# EAGLE design Gyro Board (EAGLE 6.5.0)
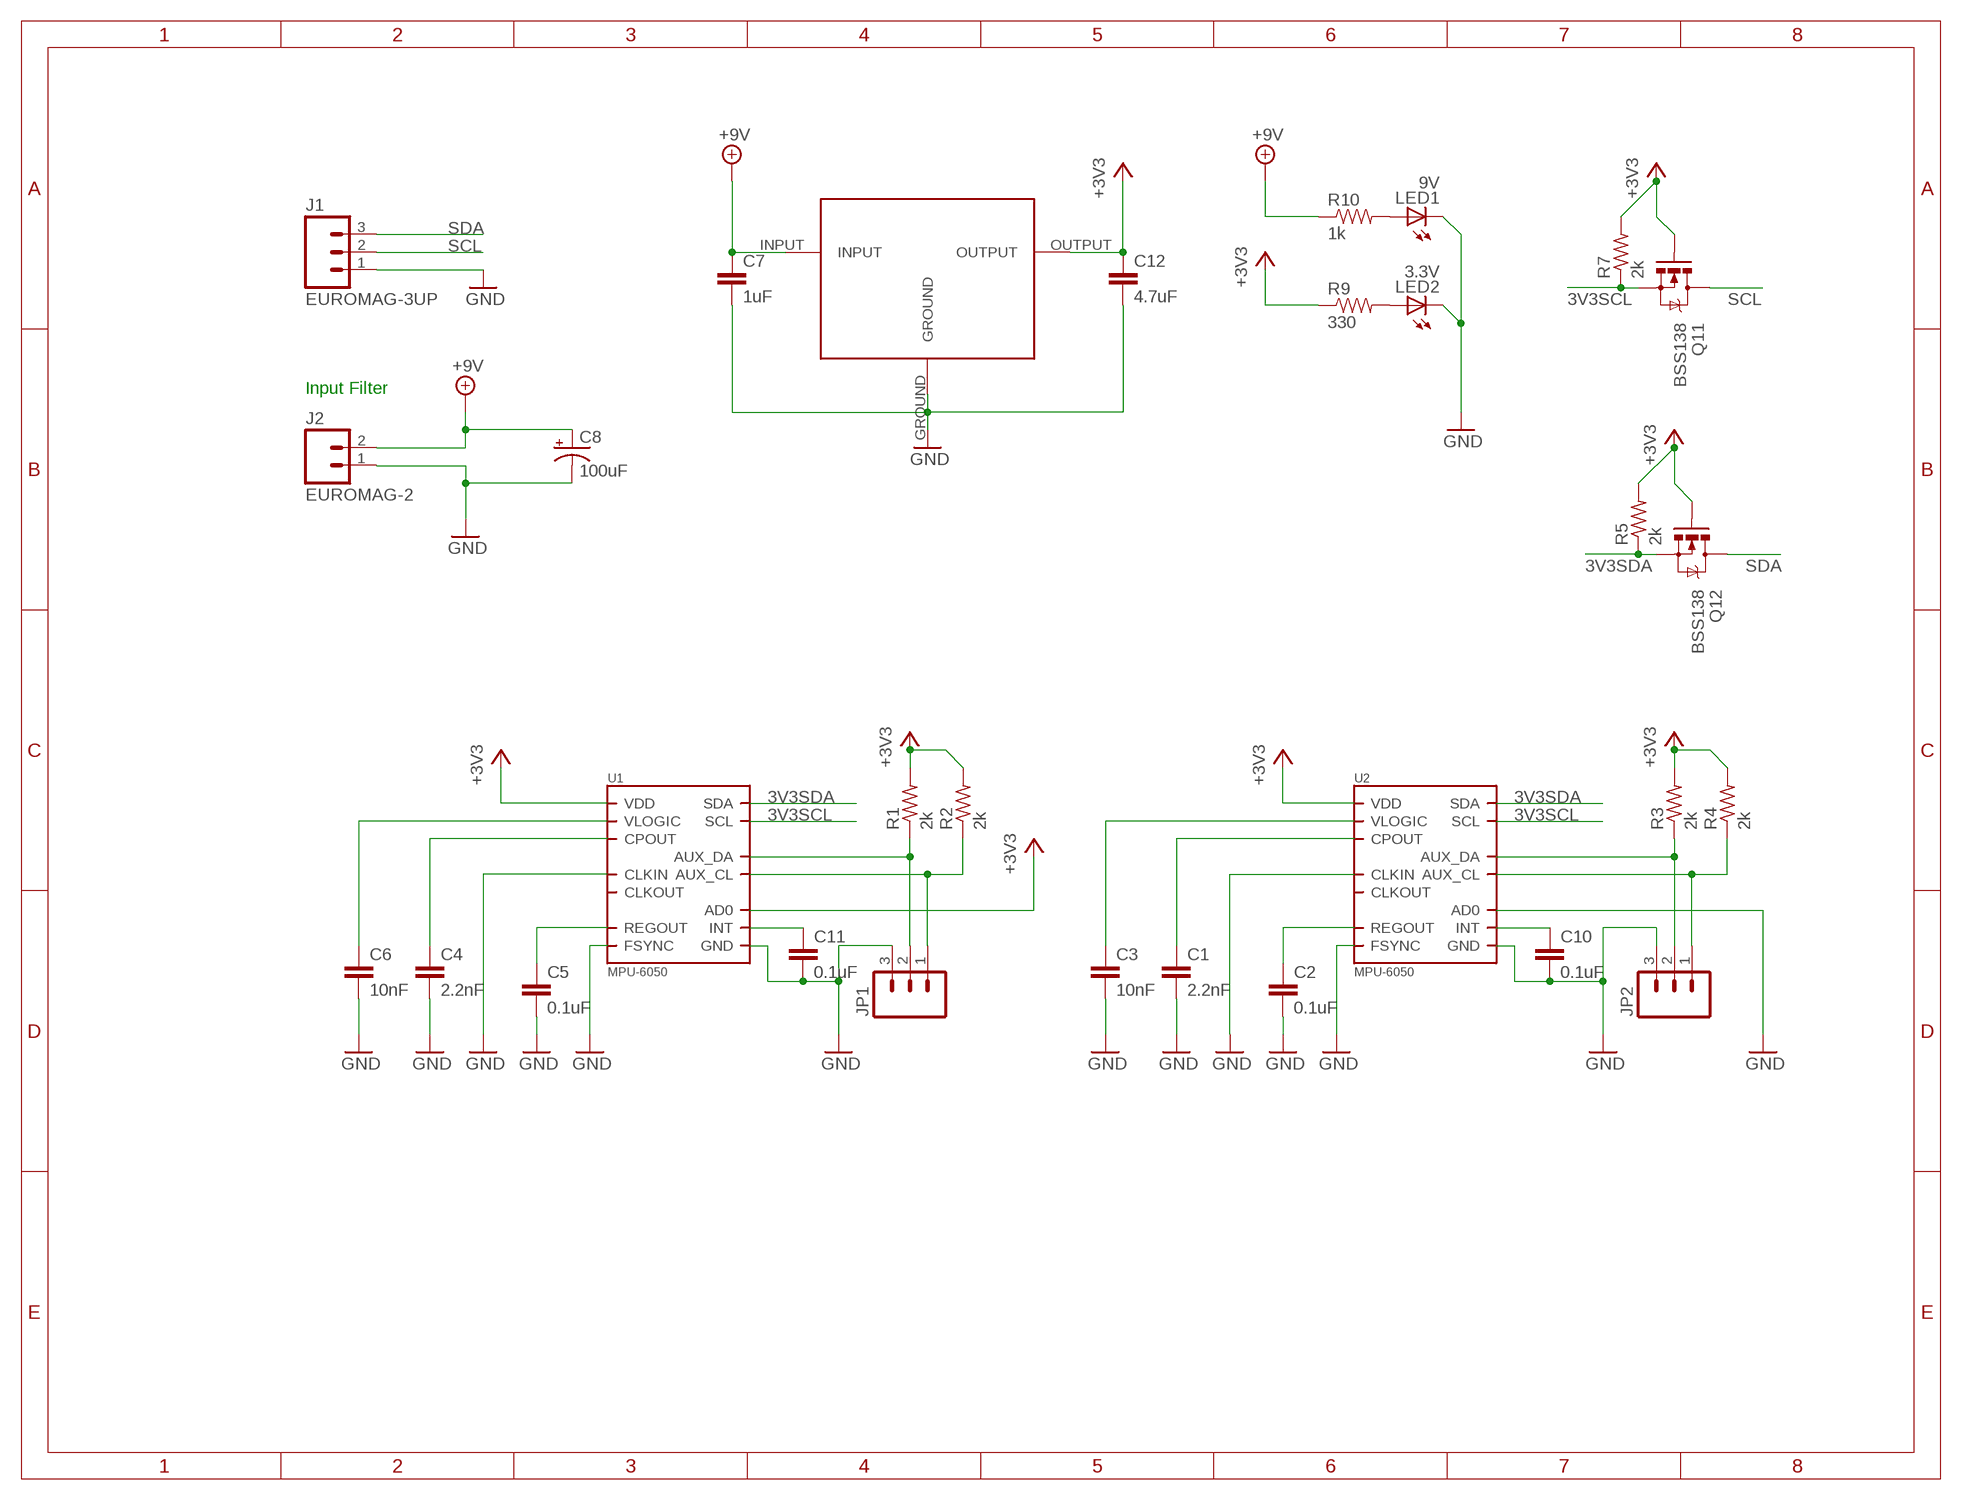
[diagram p0: schematic, sheet 1]

## Parts
3.3V  LP2950  [TO-252]
C1  2.2nF  CAP0805  [0805]
C2  0.1uF  CAP0805  [0805]
C3  10nF  CAP0805  [0805]
C4  2.2nF  CAP0805  [0805]
C5  0.1uF  CAP0805  [0805]
C6  10nF  CAP0805  [0805]
C7  1uF  CAP0805  [0805]
C8  100uF  CPOL-US153CLV-0605  [153CLV-0605]
C10  0.1uF  CAP0805  [0805]
C11  0.1uF  CAP0805  [0805]
C12  4.7uF  CAP0805  [0805]
J1  EUROMAG-3UP  [M3-UP]
J2  EUROMAG-2  [M2-UP]
JP1  M03LOCK  [1X03_LOCK]
JP2  M03LOCK  [1X03_LOCK]
LED1  9V  LEDCHIP-LED0805  [CHIP-LED0805]
LED2  3.3V  LEDCHIP-LED0805  [CHIP-LED0805]
Q11  BSS138  MOSFET-NCHANNELSMD  [SOT23-3]
Q12  BSS138  MOSFET-NCHANNELSMD  [SOT23-3]
R1  2k  R-US_M0805  [M0805]
R2  2k  R-US_M0805  [M0805]
R3  2k  R-US_M0805  [M0805]
R4  2k  R-US_M0805  [M0805]
R5  2k  R-US_R0805  [R0805]
R7  2k  R-US_R0805  [R0805]
R9  330  RESISTOR0805-RES  [0805]
R10  1k  RESISTOR0805-RES  [0805]
U1  MPU-6050  [QFN.24.4X4]
U2  MPU-6050  [QFN.24.4X4]

## Nets
3V3SCL: Q11.2(S) R7.1 U1.23(SCL) U2.23(SCL)
3V3SDA: Q12.2(S) R5.1 U1.24(SDA) U2.24(SDA)
+3V3: 3.3V.OUTPUT C12.1 Q11.1(G) Q12.1(G) R1.2 R2.2 R3.2 R4.2 R5.2 R7.2 R9.1 U1.9(AD0) U1.13(VDD) U2.13(VDD)
+9V: 3.3V.INPUT C7.1 C8.+ J2.2 R10.1
GND: 3.3V.GROUND C1.2 C2.2 C3.2 C4.2 C5.2 C6.2 C7.2 C8.- C10.2 C11.2 C12.2 J1.1 J2.1 JP1.3 JP2.3 LED1.C LED2.C U1.1(CLKIN) U1.11(FSYNC) U1.18(GND) U2.1(CLKIN) U2.9(AD0) U2.11(FSYNC) U2.18(GND)
N$1: JP1.2 R1.1 U1.6(AUX_DA)
N$2: JP1.1 R2.1 U1.7(AUX_CL)
N$3: JP2.2 R3.1 U2.6(AUX_DA)
N$4: JP2.1 R4.1 U2.7(AUX_CL)
N$5: C3.1 U2.8(VLOGIC)
N$6: C6.1 U1.8(VLOGIC)
N$7: C5.1 U1.10(REGOUT)
N$8: LED1.A R10.2
N$9: LED2.A R9.2
N$10: C4.1 U1.20(CPOUT)
N$11: C11.1 U1.12(INT)
N$13: C1.1 U2.20(CPOUT)
N$14: C10.1 U2.12(INT)
N$15: C2.1 U2.10(REGOUT)
SCL: J1.2 Q11.3(D)
SDA: J1.3 Q12.3(D)
Unconnected: U1.22(CLKOUT) U2.22(CLKOUT)

## Notes on the sheet
- Input Filter

## Library data of the parts
3.3V = NASA_LIB:LP2950
C1-C7 C10-C12 = SparkFun:CAP: Capacitor Standard 0603 ceramic capacitor, and 0.1" leaded capacitor.
C8 = rcl:CPOL-US: POLARIZED CAPACITOR, American symbol
J1 = NASA_LIB:EUROMAG-3
J2 = NASA_LIB:EUROMAG-2
JP1 JP2 = SparkFun-Connectors:M03: Header 3 Standard 3-pin 0.1" header. Use with straight break away headers (SKU : PRT-00116), right angle break away headers (PRT-00553), swiss pins (PRT-00743), machine pins (PRT-00117), and female headers (PRT-00115). Molex polarized connector foot print use with SKU : PRT-08232 with associated crimp pins and housings.
LED1 LED2 = adafruit:LED: LED OSRAM: - CHIPLED LG R971, LG N971, LY N971, LG Q971, LY Q971, LO R971, LY R971 LH N974, LH R974 LS Q976, LO Q976, LY Q976 LO Q996 - Hyper CHIPLED LW Q18S LB Q993, LB Q99A, LB R99A - SideLED LS A670, LO A670, LY A670, LG A670, LP A670 LB A673, LV A673, LT A673, LW A673 LH A674 LY A675 LS A676, LA A676, LO A676, LY A676, LW A676 LS A679, LY A679, LG A679 - Hyper Micro SIDELED® LS Y876, LA Y876, LO Y876, LY Y876 LT Y87S - SmartLED LW L88C, LW L88S LB L89C, LB L89S, LG L890 LS L89K, LO L89K, LY L89K LS L896, LA L896, LO L896, LY L896 - TOPLED LS T670, LO T670, LY T670, LG T670, LP T670 LSG T670, LSP T670, LSY T670, LOP T670, LYG T670 LG T671, LOG T671, LSG T671 LB T673, LV T673, LT T673, LW T673 LH T674 LS T676, LA T676, LO T676, LY T676, LB T676, LH T676, LSB T676, LW T676 LB T67C, LV T67C, LT T67C, LS T67K, LO T67K, LY T67K, LW E67C LS E67B, LA E67B, LO E67B, LY E67B, LB E67C, LV E67C, LT E67C LW T67C LS T679, LY T679, LG T679 LS T770, LO T770, LY T770, LG T770, LP T770 LB T773, LV T773, LT T773, LW T773 LH T774 LS E675, LA E675, LY E675, LS T675 LS T776, LA T776, LO T776, LY T776, LB T776 LHGB T686 LT T68C, LB T68C - Hyper Mini TOPLED® LB M676 - Mini TOPLED Santana® LG M470 LS M47K, LO M47K, LY M47K Source: http://www.osram.convergy.de/
Q11 Q12 = SparkFun:MOSFET-NCHANNEL
R1-R5 R7 = adafruit:R-US_: RESISTOR, American symbol
R9 R10 = SparkFun:RESISTOR: Resistor Basic schematic elements and footprints for 0603, 1206, and PTH resistors.
U1 U2 = invensense:MPU-6050

## Board
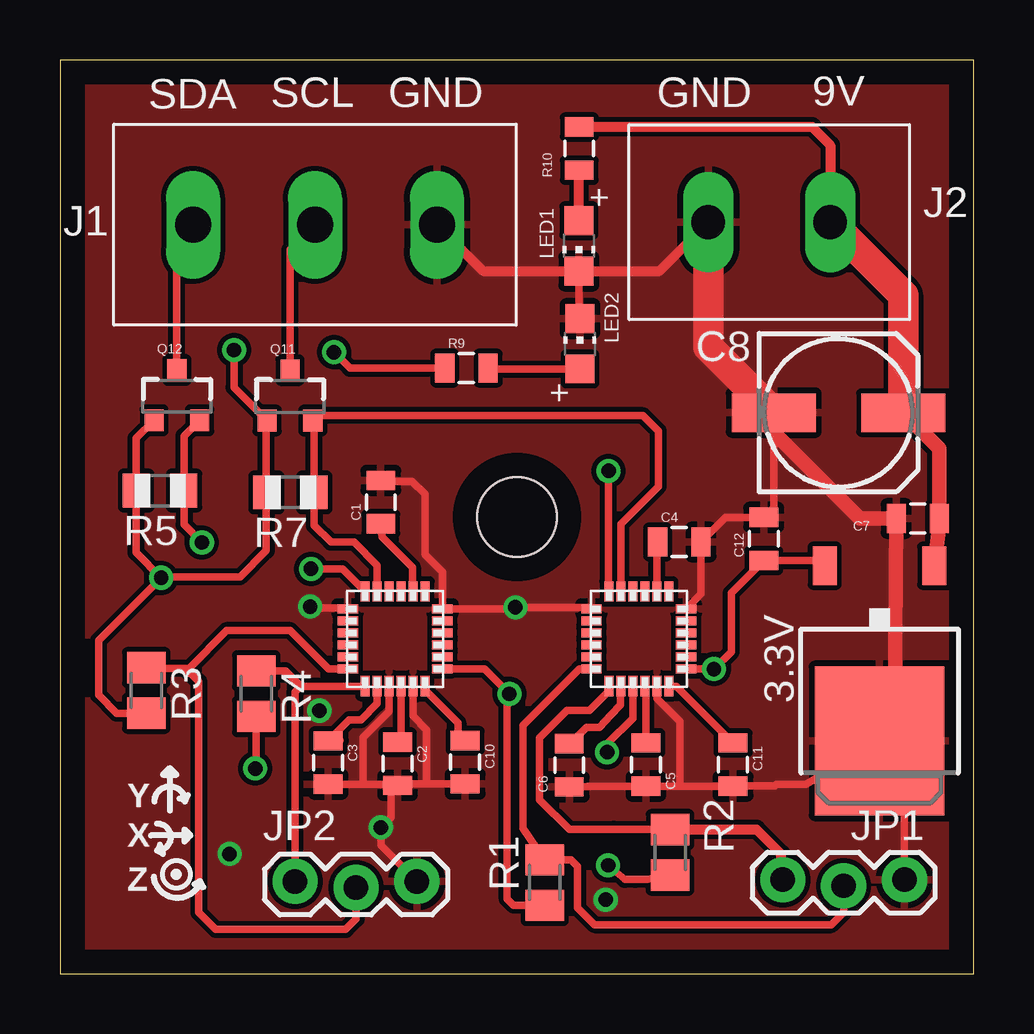
[diagram p1: board, top side]
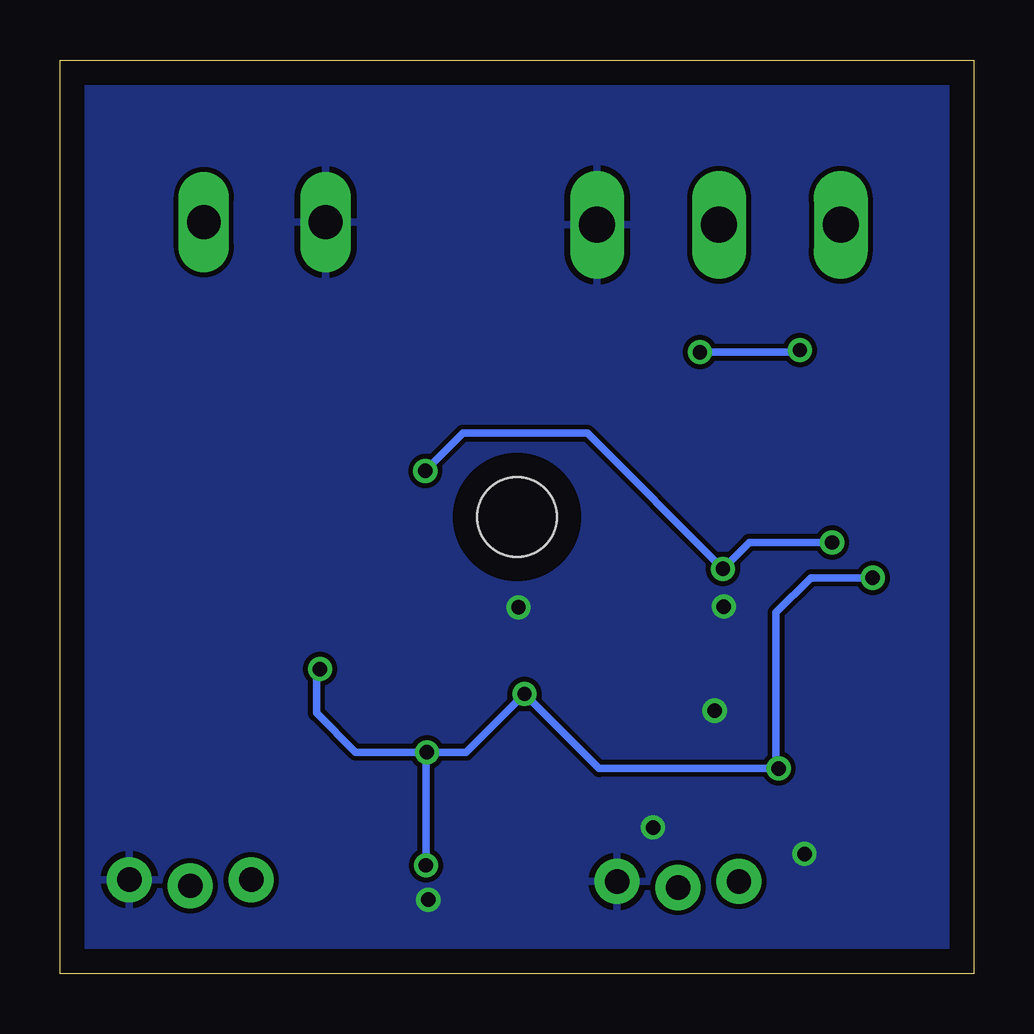
[diagram p2: board, bottom side, seen from below]

Size 38.1 x 38.1 mm. Coordinates in mm from the lower left corner, seen from the top.
Outline: 0,0 38.1,0 38.1,38.1 0,38.1 0,0
Copper layers (1*16): Top 0.035mm / dielectric 1.5mm / Bottom 0.035mm
Design rules "default": minimum track width 10mil, minimum drill 24mil, track to track 8mil, track to pad 8mil, pad to pad 8mil, via to via 8mil, smd to smd 8mil, copper to edge 40mil, drill to drill 8mil, minimum pad ring 10mil, minimum via ring 8mil, stop-mask expansion 4mil, vias tented up to drill 0mil, thermal gap 10mil

### Footprints (pad centres in the part's own frame; a part is rotated, then mirrored left to right if it is on the bottom)
TO-252 = smd 5.4 x 6.2: GROUND 0,2.5 | smd 1 x 1.6: INPUT -2.28,-4.8; OUTPUT 2.28,-4.8
0805 = smd 0.8 x 1.2: 1 -0.9,0; 2 0.9,0
153CLV-0605 = smd 3.5 x 1.6: + 2.7,0; - -2.7,0
M3-UP = drill 1.5 long: 1 -5.08,0; 2 0,0; 3 5.08,0
M2-UP = drill 1.4 long: 1 -2.54,0; 2 2.54,0
1X03_LOCK = drill 1.016 pad 1.88: 1 0,0.127; 2 2.54,-0.127; 3 5.08,0.127
CHIP-LED0805 = smd 1.2 x 1.2: A 0,-1.05; C 0,1.05
SOT23-3 = smd 0.8 x 0.9: 1 -0.95,-1; 2 0.95,-1; 3 0,1.1
M0805 = smd 1.3 x 1.6: 1 -0.95,0; 2 0.95,0
R0805 = smd 1.1 x 1.4: 1 -1,0; 2 1,0
QFN.24.4X4 = smd 0.85 x 0.38: 1 -1.975,1.25; 2 -1.975,0.75; 3 -1.975,0.25; 4 -1.975,-0.25; 5 -1.975,-0.75; 6 -1.975,-1.25; 13 1.975,-1.25; 14 1.975,-0.75; 15 1.975,-0.25; 16 1.975,0.25; 17 1.975,0.75; 18 1.975,1.25 | smd 0.38 x 0.85: 7 -1.25,-1.975; 8 -0.75,-1.975; 9 -0.25,-1.975; 10 0.25,-1.975; 11 0.75,-1.975; 12 1.25,-1.975; 19 1.25,1.975; 20 0.75,1.975; 21 0.25,1.975; 22 -0.25,1.975; 23 -0.75,1.975; 24 -1.25,1.975
STAND-OFF = hole 3.302: 0,0

### Placement (x,y rotation side)
3.3V  34.16,12.22 180 top
C1  13.37,19.67 90 top
C2  14.07,8.76 270 top
C3  11.17,8.81 270 top
C4  25.82,18.01 0 top
C5  24.43,8.73 270 top
C6  21.23,8.7 270 top
C7  35.76,18.99 180 top
C8  32.45,23.4 0 top
C10  16.89,8.82 270 top
C11  28.06,8.73 270 top
C12  29.34,18.14 90 top
J1  10.63,31.24 180 top
J2  29.57,31.34 0 top
JP1  30.13,3.8 0 top
JP2  9.8,3.73 0 top
LED1  21.63,30.35 180 top
LED2  21.67,26.27 0 top
Q11  9.59,24.07 0 top
Q12  4.87,24.08 0 top
R1  20.21,3.81 270 top
R2  25.43,5.07 270 top
R3  3.6,11.82 270 top
R4  8.18,11.68 270 top
R5  4.17,20.15 180 top
R7  9.6,20.07 180 top
R9  16.94,25.26 0 top
R10  21.65,34.41 270 top
U1  24.13,13.97 0 top
U2  13.97,13.97 0 top
U$3  [STAND-OFF]  19.05,19.05 90 top

### Tracks (layer width: path | path; a pad name or v marks a point on that pad's centre or on a via)
3V3SCL
  Top 0.305: U1.23 23.38,18.76 24.94,20.32 24.94,22.64 24.31,23.27 10.74,23.27 Q11.2 10.6,23 R7.1 10.6,18.69 11.3,18 12.25,18 13.22,17.03 U2.23 | U2.23
3V3SDA  (via drill 0.6)
  Top 0.305: Q12.2 5.17,22.43 R5.1 5.17,18.73 v5.91,17.99 | U1.24 22.87,15.95 v22.87,20.97 | v10.46,16.89 11.78,16.89 U2.24
  Bottom 0.305: v22.87,20.97 21.3,22.54 16.12,22.54 v10.46,16.89 9.37,17.99 v5.91,17.99
+3V3  (via drill 0.6)
  Top 0.305: U1.13 26.12,12.71 v27.26,12.71 27.98,13.43 27.98,15.88 C12.1 31.91,17.24 3.3V.OUTPUT | U1.9 23.88,10.66 22.83,9.61 22.83,9.27 v22.8,9.24 | U2.13 17.69,12.72 v18.73,11.67 18.64,11.58 18.64,3.13 18.91,2.86 R1.2 | R2.2 24.48,3.94 23.98,3.94 23.55,3.94 v22.85,4.53 | R4.2 8.18,8.61 v8.14,8.56 | R3.2 2.36,10.87 1.61,11.63 1.61,13.9 v4.22,16.51 | v4.22,16.51 3.17,17.56 R5.2 3.17,22.33 Q12.1 | v4.22,16.51 4.26,16.55 7.51,16.55 8.6,17.65 R7.2 8.6,23.03 Q11.1 7.26,24.45 v7.26,26.01 | v11.42,25.92 12.08,25.25 R9.1
  Bottom 0.305: v22.8,9.24 25.77,9.24 27.4,10.88 27.4,12.56 v27.26,12.71 | v22.8,9.24 21.17,9.24 v18.73,11.67 15.63,8.56 v8.14,8.56 8.25,8.68 8.25,15.06 6.8,16.51 v4.22,16.51 | v22.85,4.53 22.85,9.2 v22.8,9.24 | v11.42,25.92 7.35,25.92 v7.26,26.01
+9V
  Top 0.406: R10.1 31.35,35.31 32.11,34.55 J2.2
  Top 0.61: 3.3V.INPUT 36.69,19.02 C7.1 36.66,21.89 C8.+
  Top 1.27: J2.2 35.15,28.29 C8.+
GND  (via drill 0.6)
  Top 0.305: U1.11 24.88,11.48 25.84,10.52 25.84,7.82 | 25.84,7.82 C11.2 29.79,7.83 29.86,7.9 31.1,7.9 3.3V.GROUND 35.21,10.29 JP1.3 | 25.84,7.82 C5.2 21.98,7.83 C6.2 | C10.2 15.29,7.92 | 15.29,7.92 13.79,7.92 | 13.79,7.92 C2.2 | U2.11 14.72,10.75 15.29,10.18 15.29,7.92 | U1.18 26.72,15.83 C4.2 27.75,19.04 C12.2 29.75,19.45 C8.- 29.34,22.98 | U1.1 22.09,15.28 v18.99,15.28 18.93,15.22 U2.18 15.95,16.76 15.22,17.49 15.22,20 14.69,20.53 13.41,20.53 C1.2 | U2.1 12.02,15.22 12.04,15.25 10.49,15.25 v10.43,15.31 | LED1.C 21.63,27.36 LED2.C | 13.79,7.92 13.78,7.91 12.63,7.91 | 12.63,7.91 C3.2 | 13.79,7.92 13.79,6.52 v13.38,6.11 13.38,5.36 JP2.3 | U2.9 13.72,10.94 12.63,9.86 12.63,7.91
  Top 0.406: J1.1 17.65,29.3 LED1.C 24.99,29.3 J2.1
  Top 0.61: 3.3V.GROUND 34.8,11.6 C7.2 33.34,18.98 29.34,22.98
  Top 1.27: J2.1 27.03,26.13 C8.-
  Bottom 0.305: v10.43,15.31 | v10.43,15.31 10.46,15.28
  other vias: 7.07,5 22.75,3.09 10.81,10.97
  pour Bottom: 0.44,37.74 0.44,0.48 37.57,0.48 37.57,37.68 0.5,37.68
  pour Top: 0.37,37.74 0.37,0.42 37.7,0.42 37.7,37.8 0.5,37.8
N$1
  Top 0.305: U1.6 21.65,12.72 19.3,10.37 19.3,6.06 R1.1 21.3,4.76 21.58,4.48 21.58,2.76 22.29,2.06 32.15,2.06 32.67,2.57 JP1.2
N$2
  Top 0.305: U1.7 22.88,11.8 22.07,10.99 21.13,10.99 19.98,9.84 19.98,7.26 21.23,6.03 23.09,6.03 R2.1
  Top 0.406: R2.1 29.04,6.02 30.05,5.02 30.05,4.01 JP1.1
N$3
  Top 0.305: U2.6 11.19,12.72 9.6,14.31 6.95,14.31 5.38,12.75 5.23,12.75 | 5.23,12.75 3.62,12.75 R3.1 | 5.23,12.75 5.79,12.18 5.79,2.56 6.49,1.86 11.91,1.86 12.35,2.3 JP2.2
N$4
  Top 0.305: JP2.1 9.8,11.75 10.04,12 | U2.7 10.04,12 | R4.1 9.4,12.63 10.04,12
N$5
  Top 0.305: 11.68,9.73 C3.1 12.06,10.6 12.54,10.6 13.22,11.27 U2.8
N$6
  Top 0.305: C6.1 21.95,10.27 22.48,10.27 22.97,10.81 23.36,11.22 23.36,11.97 U1.8
N$7
  Top 0.305: C5.1 24.43,11.95 U1.10
N$8
  Top 0.406: LED1.A 21.63,33.49 R10.2
N$9
  Top 0.305: R9.2 17.88,25.22 LED2.A
N$10
  Top 0.305: U1.20 24.88,17.97 C4.1
N$11
  Top 0.305: U1.12 25.69,12 C11.1
N$13
  Top 0.305: C1.1 13.42,18.21 14.69,16.94 14.69,15.98 U2.20
N$14
  Top 0.305: U2.12 15.22,11.84 16.59,10.47 16.59,9.73 C10.1
N$15
  Top 0.305: U2.10 14.22,9.81 C2.1
SCL
  Top 0.305: Q11.3 9.59,30.19 J1.2
SDA
  Top 0.305: Q12.3 4.87,30.56 J1.3

### Text on the board
tPlace: Y | X | Z
tNames: SDA | SCL | GND | GND | 9V